# EAGLE design brushless_module_v3 (EAGLE 6.5.0)

## Sheet 1 of 13
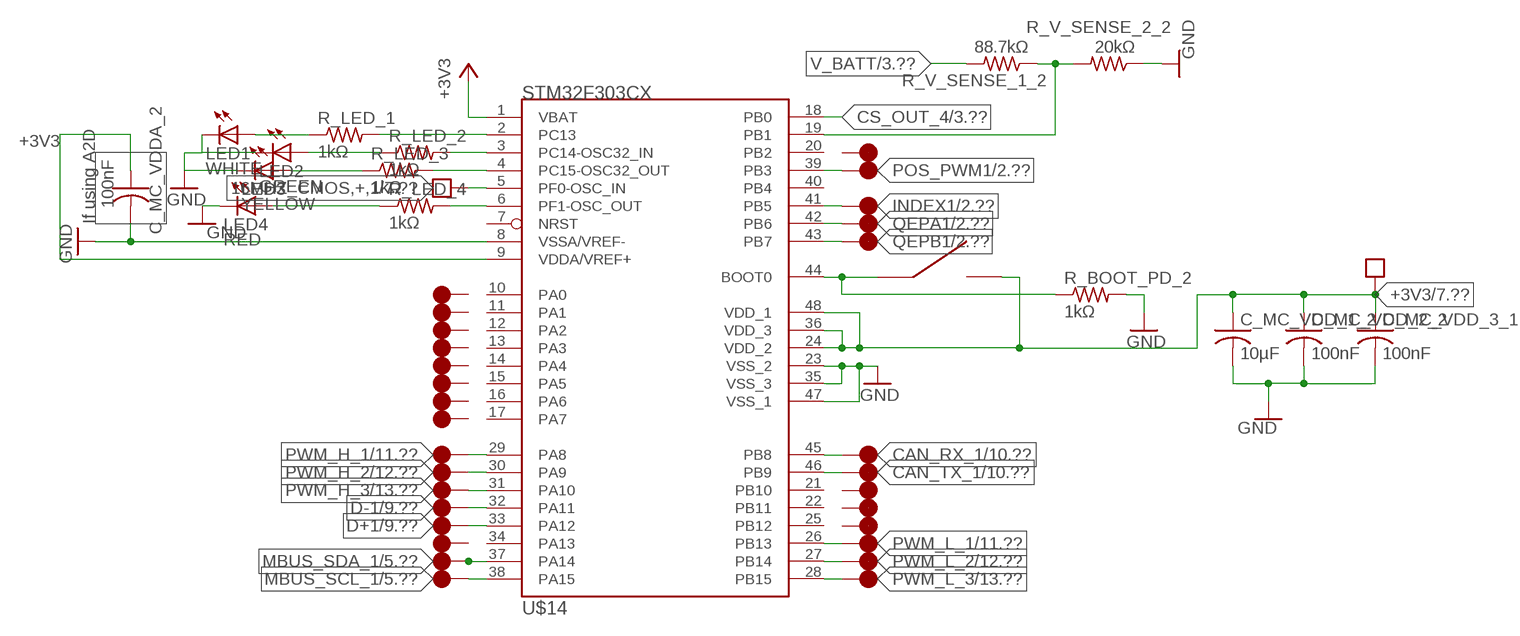
[diagram p0: schematic, sheet 1]

### Parts
C_MC_VDD_1_2  10µF  C-USC0402  [C0402]
C_MC_VDD_2_2  100nF  C-USC0402  [C0402]
C_MC_VDD_3_1  100nF  C-USC0402  [C0402]
C_MC_VDDA_2  100nF  C-USC0402  [C0402]
LED1  WHITE  LED  [0402]
LED2  GREEN  LED  [0402]
LED3  YELLOW  LED  [0402]
LED4  RED  LED  [0402]
R_BOOT_PD_2  1kΩ  R-US_R0402  [R0402]
R_LED_1  1kΩ  R-US_R0402  [R0402]
R_LED_2  1kΩ  R-US_R0402  [R0402]
R_LED_3  1kΩ  R-US_R0402  [R0402]
R_LED_4  1kΩ  R-US_R0402  [R0402]
R_V_SENSE_1_2  88.7kΩ  R-US_R0402  [R0402]
R_V_SENSE_2_2  20kΩ  R-US_R0402  [R0402]
SW2  B3U  [B3U]
U$14  STM32F303CX  [LQFP48]

### Nets
16MHZ_CMOS,+,1: U$14.5(PF0-OSC_IN) ; supply symbol labelled BLOCK_REQUIREMENT ; also sheet 7
+3V3: C_MC_VDD_1_2.1 C_MC_VDD_2_2.1 C_MC_VDD_3_1.1 C_MC_VDDA_2.1 SW2.P$2 U$14.1(VBAT) U$14.9(VDDA/VREF+) U$14.24(VDD_2) U$14.36(VDD_3) U$14.48(VDD_1) ; supply symbol labelled BLOCK_REQUIREMENT ; also sheet 2,3,5,7,8,10
BOOT0_2: R_BOOT_PD_2.1 SW2.P$1 U$14.44(BOOT0)
CAN_RX_1: U$14.45(PB8) ; supply symbol labelled BLOCK_CONNECTOR ; also sheet 10
CAN_TX_1: U$14.46(PB9) ; supply symbol labelled BLOCK_CONNECTOR ; also sheet 10
CS_OUT_4: U$14.18(PB0) ; also sheet 3
D+1: U$14.33(PA12) ; supply symbol labelled BLOCK_CONNECTOR ; also sheet 9
D-1: U$14.32(PA11) ; supply symbol labelled BLOCK_CONNECTOR ; also sheet 9
GND: C_MC_VDD_1_2.2 C_MC_VDD_2_2.2 C_MC_VDD_3_1.2 C_MC_VDDA_2.2 LED1.CATHODE(C) LED2.CATHODE(C) LED3.CATHODE(C) LED4.CATHODE(C) R_BOOT_PD_2.2 R_V_SENSE_2_2.1 U$14.8(VSSA/VREF-) U$14.23(VSS_2) U$14.35(VSS_3) U$14.47(VSS_1) ; also sheet 2,3,4,5,6,7,8,9,10,11,12,13
INDEX1: U$14.41(PB5) ; supply symbol labelled BLOCK_CONNECTOR ; also sheet 2
LED_1: R_LED_1.2 U$14.2(PC13)
LED_2: R_LED_2.2 U$14.3(PC14-OSC32_IN)
LED_3: R_LED_3.2 U$14.4(PC15-OSC32_OUT)
LED_4: R_LED_4.2 U$14.6(PF1-OSC_OUT)
MBUS_SCL_1: U$14.38(PA15) ; supply symbol labelled BLOCK_CONNECTOR ; also sheet 5
MBUS_SDA_1: U$14.37(PA14) ; supply symbol labelled BLOCK_CONNECTOR ; also sheet 5
N$4: LED4.ANODE(A) R_LED_4.1
N$5: LED3.ANODE(A) R_LED_3.1
N$8: LED2.ANODE(A) R_LED_2.1
N$10: LED1.ANODE(A) R_LED_1.1
POS_PWM1: U$14.39(PB3) ; supply symbol labelled BLOCK_CONNECTOR ; also sheet 2
PWM_H_1: U$14.29(PA8) ; supply symbol labelled BLOCK_CONNECTOR ; also sheet 11
PWM_H_2: U$14.30(PA9) ; supply symbol labelled BLOCK_CONNECTOR ; also sheet 12
PWM_H_3: U$14.31(PA10) ; supply symbol labelled BLOCK_CONNECTOR ; also sheet 13
PWM_L_1: U$14.26(PB13) ; supply symbol labelled BLOCK_CONNECTOR ; also sheet 11
PWM_L_2: U$14.27(PB14) ; supply symbol labelled BLOCK_CONNECTOR ; also sheet 12
PWM_L_3: U$14.28(PB15) ; supply symbol labelled BLOCK_CONNECTOR ; also sheet 13
QEPA1: U$14.42(PB6) ; supply symbol labelled BLOCK_CONNECTOR ; also sheet 2
QEPB1: U$14.43(PB7) ; supply symbol labelled BLOCK_CONNECTOR ; also sheet 2
V_BATT: R_V_SENSE_1_2.2 ; also sheet 3,4,6
VS_OUT: R_V_SENSE_1_2.1 R_V_SENSE_2_2.2 U$14.19(PB1)
Unconnected: U$14.7(NRST) U$14.10(PA0) U$14.11(PA1) U$14.12(PA2) U$14.13(PA3) U$14.14(PA4) U$14.15(PA5) U$14.16(PA6) U$14.17(PA7) U$14.20(PB2) U$14.21(PB10) U$14.22(PB11) U$14.25(PB12) U$14.34(PA13) U$14.40(PB4)

### Notes on the sheet
- If using A2D

## Sheet 2 of 13
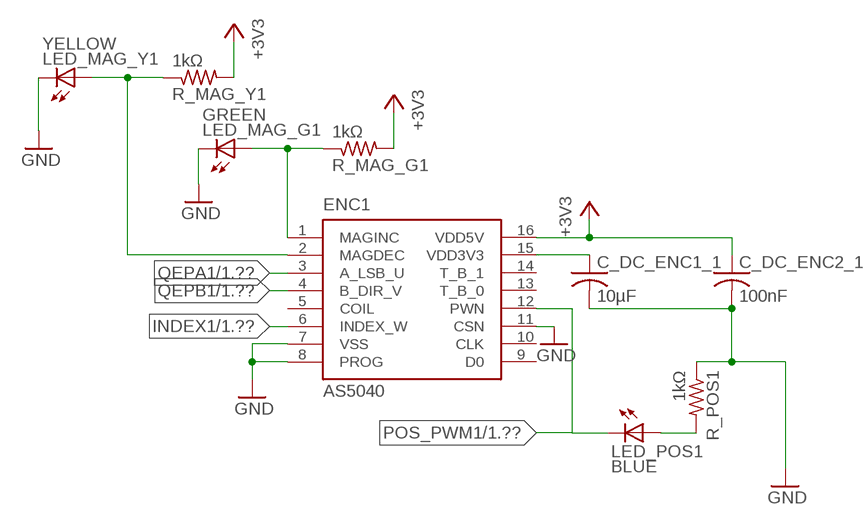
[diagram p1: schematic, sheet 2]

### Parts
C_DC_ENC1_1  10µF  C-USC0402  [C0402]
C_DC_ENC2_1  100nF  C-USC0402  [C0402]
ENC1  AS5040  [SSOP16]
LED_MAG_G1  GREEN  LED  [0402]
LED_MAG_Y1  YELLOW  LED  [0402]
LED_POS1  BLUE  LED  [0402]
R_MAG_G1  1kΩ  R-US_R0402  [R0402]
R_MAG_Y1  1kΩ  R-US_R0402  [R0402]
R_POS1  1kΩ  R-US_R0402  [R0402]

### Nets
+3V3: C_DC_ENC2_1.1 ENC1.16(VDD5V) R_MAG_G1.2 R_MAG_Y1.2 ; also sheet 1,3,5,7,8,10
ENC_3V3_1: C_DC_ENC1_1.1 ENC1.15(VDD3V3)
GND: C_DC_ENC1_1.2 C_DC_ENC2_1.2 ENC1.7(VSS) ENC1.8(PROG) ENC1.11(CSN) LED_MAG_G1.CATHODE(C) LED_MAG_Y1.CATHODE(C) R_POS1.1 ; also sheet 1,3,4,5,6,7,8,9,10,11,12,13
INDEX1: ENC1.6(INDEX_W) ; also sheet 1
MAGDEC1: ENC1.2(MAGDEC) LED_MAG_Y1.ANODE(A) R_MAG_Y1.1
MAGINC1: ENC1.1(MAGINC) LED_MAG_G1.ANODE(A) R_MAG_G1.1
N$15: LED_POS1.ANODE(A) R_POS1.2
POS_PWM1: ENC1.12(PWN) LED_POS1.CATHODE(C) ; also sheet 1
QEPA1: ENC1.3(A_LSB_U) ; also sheet 1
QEPB1: ENC1.4(B_DIR_V) ; also sheet 1
Unconnected: ENC1.5(COIL) ENC1.9(D0) ENC1.10(CLK) ENC1.13(T_B_0) ENC1.14(T_B_1)

## Sheet 3 of 13
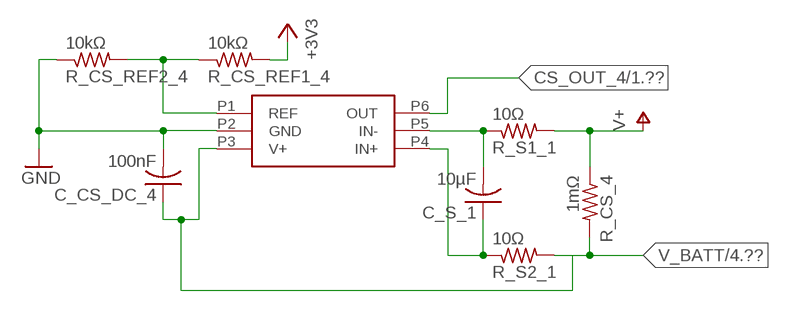
[diagram p2: schematic, sheet 3]

### Parts
C_CS_DC_4  100nF  C-USC0402  [C0402]
C_S_1  10µF  C-USC0402  [C0402]
CS_4  INA21X  [SC70]
R_CS_4  1mΩ  R-US_R1206  [R1206]
R_CS_REF1_4  10kΩ  R-US_R0402  [R0402]
R_CS_REF2_4  10kΩ  R-US_R0402  [R0402]
R_S1_1  10Ω  R-US_R0402  [R0402]
R_S2_1  10Ω  R-US_R0402  [R0402]

### Nets
+3V3: R_CS_REF1_4.2 ; also sheet 1,2,5,7,8,10
CS_OUT_4: CS_4.P6(OUT) ; also sheet 1
GND: C_CS_DC_4.2 CS_4.P2(GND) R_CS_REF2_4.1 ; also sheet 1,2,4,5,6,7,8,9,10,11,12,13
IN+_1: C_S_1.1 CS_4.P4(IN+) R_S2_1.1
IN-_1: C_S_1.2 CS_4.P5(IN-) R_S1_1.1
V+: R_CS_4.1 R_S1_1.2 ; also sheet 8,11,12,13
V_BATT: C_CS_DC_4.1 CS_4.P3(V+) R_CS_4.2 R_S2_1.2 ; also sheet 1,4,6
V_REF_CS: CS_4.P1(REF) R_CS_REF1_4.1 R_CS_REF2_4.2

## Sheet 4 of 13
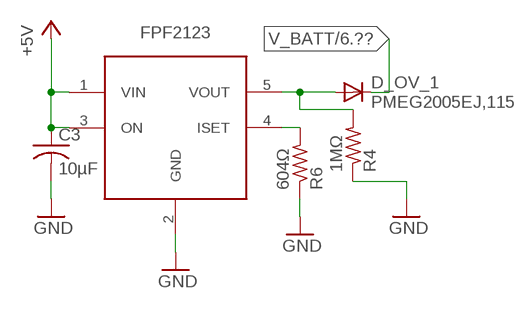
[diagram p3: schematic, sheet 4]

### Parts
C3  10µF  C-USC0402  [C0402]
D_OV_1  PMEG2005EJ,115  DIODE-SOD323-W  [SOD323-W]
FPF2123  FPF2123  [SOT23-5L]
R4  1MΩ  R-US_R0402  [R0402]
R6  604Ω  R-US_R0402  [R0402]

### Nets
+5V: C3.1 FPF2123.1(VIN) FPF2123.3(ON) ; also sheet 9
GND: C3.2 FPF2123.2(GND) R4.1 R6.1 ; also sheet 1,2,3,5,6,7,8,9,10,11,12,13
LOAD_ISET_1: FPF2123.4(ISET) R6.2
N$17: D_OV_1.A FPF2123.5(VOUT) R4.2
V_BATT: D_OV_1.C ; also sheet 1,3,6

## Sheet 5 of 13
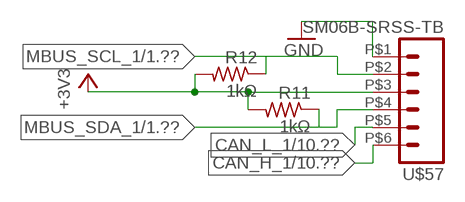
[diagram p4: schematic, sheet 5]

### Parts
R11  1kΩ  R-US_R0402  [R0402]
R12  1kΩ  R-US_R0402  [R0402]
U$57  SM06B-SRSS-TB  [SM06B-SRSS-TB]

### Nets
+3V3: R11.2 R12.2 U$57.P$3 ; also sheet 1,2,3,7,8,10
CAN_H_1: U$57.P$6 ; also sheet 10
CAN_L_1: U$57.P$5 ; also sheet 10
GND: U$57.P$1 ; also sheet 1,2,3,4,6,7,8,9,10,11,12,13
MBUS_SCL_1: R12.1 U$57.P$2 ; also sheet 1
MBUS_SDA_1: R11.1 U$57.P$4 ; also sheet 1

## Sheet 6 of 13
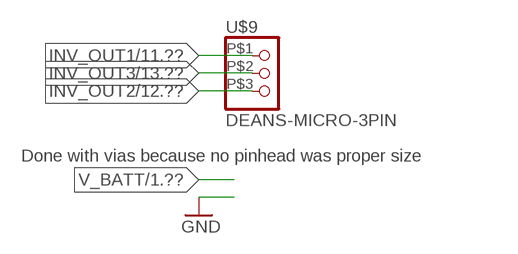
[diagram p5: schematic, sheet 6]

### Parts
U$9  DEANS-MICRO-3PIN  [DEANS-MICRO-3PIN]

### Nets
INV_OUT1: U$9.P$1 ; also sheet 11
INV_OUT2: U$9.P$3 ; also sheet 12
INV_OUT3: U$9.P$2 ; also sheet 13

### Notes on the sheet
- Done with vias because no pinhead was proper size

## Sheet 7 of 13
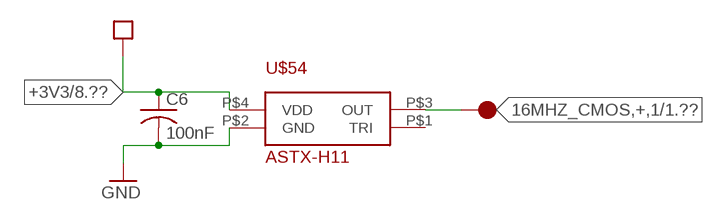
[diagram p6: schematic, sheet 7]

### Parts
C6  100nF  C-USC0402  [C0402]
U$54  ASTX-H11  [ASTX-H11]

### Nets
16MHZ_CMOS,+,1: U$54.P$3(OUT) ; supply symbol labelled BLOCK_CONNECTOR ; also sheet 1
+3V3: C6.1 U$54.P$4(VDD) ; supply symbol labelled BLOCK_REQUIREMENT ; also sheet 1,2,3,5,8,10
GND: C6.2 U$54.P$2(GND) ; also sheet 1,2,3,4,5,6,8,9,10,11,12,13
Unconnected: U$54.P$1(TRI)

## Sheet 8 of 13
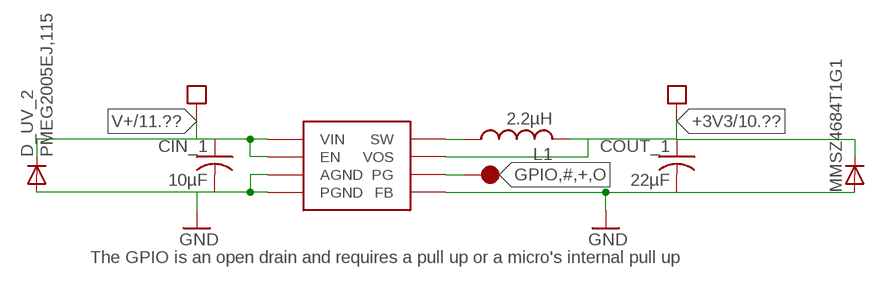
[diagram p7: schematic, sheet 8]

### Parts
CIN_1  10µF  C-USC0603  [C0603]
COUT_1  22µF  C-USC0603  [C0603]
D_UV_2  PMEG2005EJ,115  DIODE-SOD323-W  [SOD323-W]
L1  2.2µH  L-USL2012C  [L2012C]
MMSZ4684T1G1  D-SOD123  [SOD123]
U$37  TPS621XX  [8-WFDFN]

### Nets
+3V3: COUT_1.1 L1.2 MMSZ4684T1G1.1(C) U$37.P$6(VOS) ; supply symbol labelled BLOCK_REQUIREMENT ; also sheet 1,2,3,5,7,10
GND: CIN_1.2 COUT_1.2 D_UV_2.A MMSZ4684T1G1.2(A) U$37.P$1(PGND) U$37.P$4(AGND) U$37.P$5(FB) U$37.P$9(AGND) ; also sheet 1,2,3,4,5,6,7,9,10,11,12,13
GPIO,#,+,O: U$37.P$8(PG) ; supply symbol labelled BLOCK_CONNECTOR
N$3: L1.1 U$37.P$7(SW)
V+: CIN_1.1 D_UV_2.C U$37.P$2(VIN) U$37.P$3(EN) ; supply symbol labelled BLOCK_REQUIREMENT ; also sheet 3,11,12,13

### Notes on the sheet
- The GPIO is an open drain and requires a pull up or a micro's internal pull up

## Sheet 9 of 13
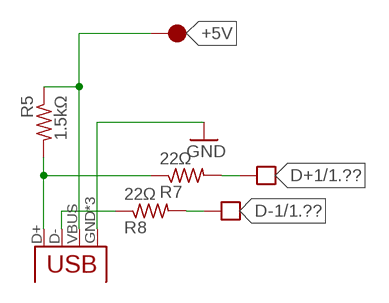
[diagram p8: schematic, sheet 9]

### Parts
R5  1.5kΩ  R-US_R0402  [R0402]
R7  22Ω  R-US_R0402  [R0402]
R8  22Ω  R-US_R0402  [R0402]
X1  USB-MICROB  [USB-MICROB]

### Nets
+5V: R5.1 X1.VBUS ; supply symbol labelled BLOCK_CONNECTOR ; also sheet 4
D+1: R7.2 ; supply symbol labelled BLOCK_REQUIREMENT ; also sheet 1
D+_IN_2: R5.2 R7.1 X1.D+
D-1: R8.2 ; supply symbol labelled BLOCK_REQUIREMENT ; also sheet 1
D-_IN_2: R8.1 X1.D-
GND: X1.GND X1.MT1(GND) X1.MT2(GND) ; also sheet 1,2,3,4,5,6,7,8,10,11,12,13

## Sheet 10 of 13
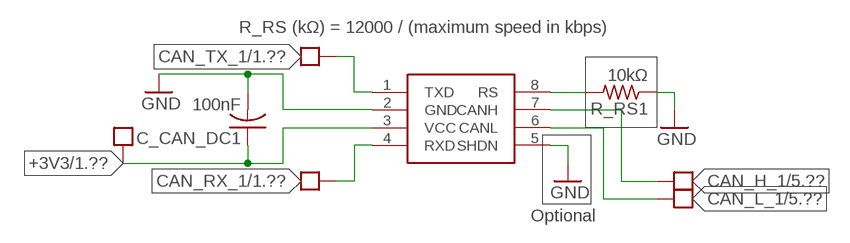
[diagram p9: schematic, sheet 10]

### Parts
C_CAN_DC1  100nF  C-USC0402  [C0402]
CAN_TRAN1  MAX3051  [SOT23-8L]
R_RS1  10kΩ  R-US_R0402  [R0402]

### Nets
+3V3: C_CAN_DC1.1 CAN_TRAN1.3(VCC) ; supply symbol labelled BLOCK_REQUIREMENT ; also sheet 1,2,3,5,7,8
CAN_H_1: CAN_TRAN1.7(CANH) ; supply symbol labelled BLOCK_REQUIREMENT ; also sheet 5
CAN_L_1: CAN_TRAN1.6(CANL) ; supply symbol labelled BLOCK_REQUIREMENT ; also sheet 5
CAN_RX_1: CAN_TRAN1.4(RXD) ; supply symbol labelled BLOCK_REQUIREMENT ; also sheet 1
CAN_TX_1: CAN_TRAN1.1(TXD) ; supply symbol labelled BLOCK_REQUIREMENT ; also sheet 1
GND: C_CAN_DC1.2 CAN_TRAN1.2(GND) CAN_TRAN1.5(SHDN) R_RS1.1 ; also sheet 1,2,3,4,5,6,7,8,9,11,12,13
N$6: CAN_TRAN1.8(RS) R_RS1.2

### Notes on the sheet
- R_RS (kΩ) = 12000 / (maximum speed in kbps)
- Optional

## Sheet 11 of 13
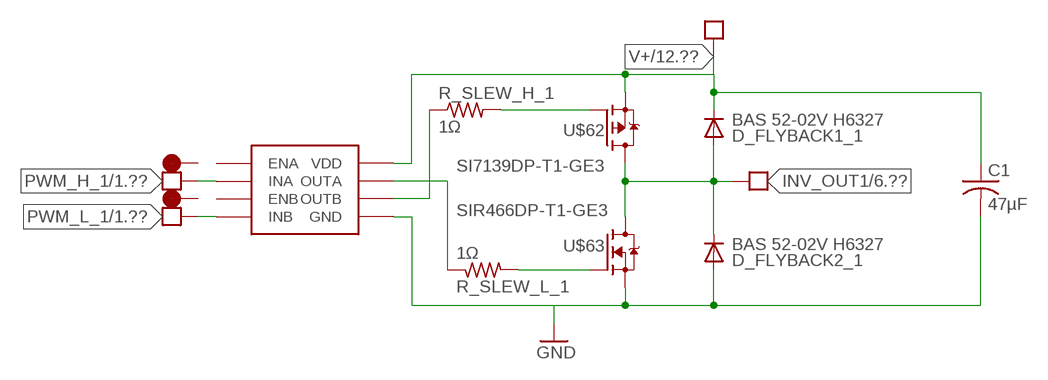
[diagram p10: schematic, sheet 11]

### Parts
C1  47µF  C-USC1206  [C1206]
D_FLYBACK1_1  BAS 52-02V H6327  DIODE-SOD523  [SOD523]
D_FLYBACK2_1  BAS 52-02V H6327  DIODE-SOD523  [SOD523]
R_SLEW_H_1  1Ω  R-US_R0402  [R0402]
R_SLEW_L_1  1Ω  R-US_R0402  [R0402]
U$62  SI7139DP-T1-GE3  [S0-8-POWERPAK]
U$63  SIR466DP-T1-GE3  [S0-8-POWERPAK]
U$64  UCC2752XUCC27524DSD  [8-WDFN]

### Nets
DRIVER_OUT_H_1: R_SLEW_H_1.1 U$64.P5(OUTB)
DRIVER_OUT_L_1: R_SLEW_L_1.1 U$64.P7(OUTA)
GATE_H_1: R_SLEW_H_1.2 U$62.4(G)
GATE_L_1: R_SLEW_L_1.2 U$63.4(G)
GND: C1.2 D_FLYBACK2_1.A U$63.1(S) U$63.2(S) U$63.3(S) U$64.EP(GND) U$64.P3(GND) ; also sheet 1,2,3,4,5,6,7,8,9,10,12,13
INV_OUT1: D_FLYBACK1_1.A D_FLYBACK2_1.C U$62.5(D) U$62.6(D) U$62.7(D) U$62.8(D) U$62.P$1(D) U$63.5(D) U$63.6(D) U$63.7(D) U$63.8(D) U$63.P$1(D) ; supply symbol labelled BLOCK_REQUIREMENT ; also sheet 6
PWM_H_1: U$64.P2(INA) ; supply symbol labelled BLOCK_REQUIREMENT ; also sheet 1
PWM_L_1: U$64.P4(INB) ; supply symbol labelled BLOCK_REQUIREMENT ; also sheet 1
V+: C1.1 D_FLYBACK1_1.C U$62.1(S) U$62.2(S) U$62.3(S) U$64.P6(VDD) ; supply symbol labelled BLOCK_REQUIREMENT ; also sheet 3,8,12,13
Unconnected: U$64.P1(ENA) U$64.P8(ENB)

## Sheet 12 of 13
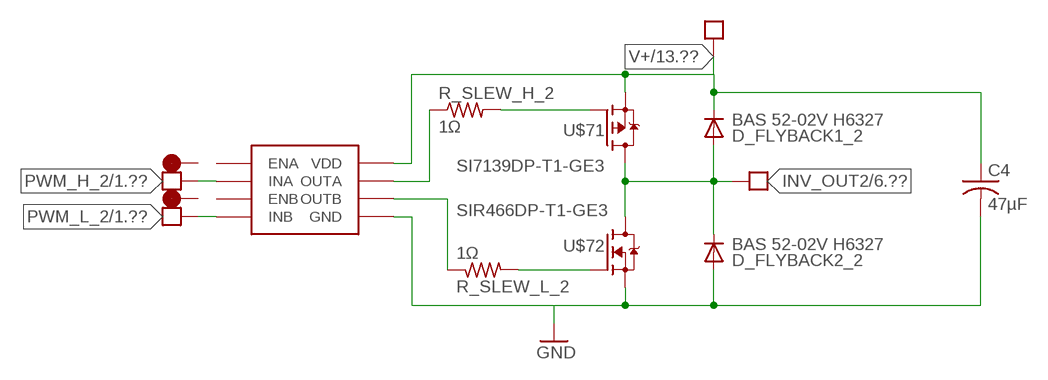
[diagram p11: schematic, sheet 12]

### Parts
C4  47µF  C-USC1206  [C1206]
D_FLYBACK1_2  BAS 52-02V H6327  DIODE-SOD523  [SOD523]
D_FLYBACK2_2  BAS 52-02V H6327  DIODE-SOD523  [SOD523]
R_SLEW_H_2  1Ω  R-US_R0402  [R0402]
R_SLEW_L_2  1Ω  R-US_R0402  [R0402]
U$71  SI7139DP-T1-GE3  [S0-8-POWERPAK]
U$72  SIR466DP-T1-GE3  [S0-8-POWERPAK]
U$73  UCC2752XUCC27524DSD  [8-WDFN]

### Nets
DRIVER_OUT_H_2: R_SLEW_H_2.1 U$73.P7(OUTA)
DRIVER_OUT_L_2: R_SLEW_L_2.1 U$73.P5(OUTB)
GATE_H_2: R_SLEW_H_2.2 U$71.4(G)
GATE_L_2: R_SLEW_L_2.2 U$72.4(G)
GND: C4.2 D_FLYBACK2_2.A U$72.1(S) U$72.2(S) U$72.3(S) U$73.EP(GND) U$73.P3(GND) ; also sheet 1,2,3,4,5,6,7,8,9,10,11,13
INV_OUT2: D_FLYBACK1_2.A D_FLYBACK2_2.C U$71.5(D) U$71.6(D) U$71.7(D) U$71.8(D) U$71.P$1(D) U$72.5(D) U$72.6(D) U$72.7(D) U$72.8(D) U$72.P$1(D) ; supply symbol labelled BLOCK_REQUIREMENT ; also sheet 6
PWM_H_2: U$73.P2(INA) ; supply symbol labelled BLOCK_REQUIREMENT ; also sheet 1
PWM_L_2: U$73.P4(INB) ; supply symbol labelled BLOCK_REQUIREMENT ; also sheet 1
V+: C4.1 D_FLYBACK1_2.C U$71.1(S) U$71.2(S) U$71.3(S) U$73.P6(VDD) ; supply symbol labelled BLOCK_REQUIREMENT ; also sheet 3,8,11,13
Unconnected: U$73.P1(ENA) U$73.P8(ENB)

## Sheet 13 of 13
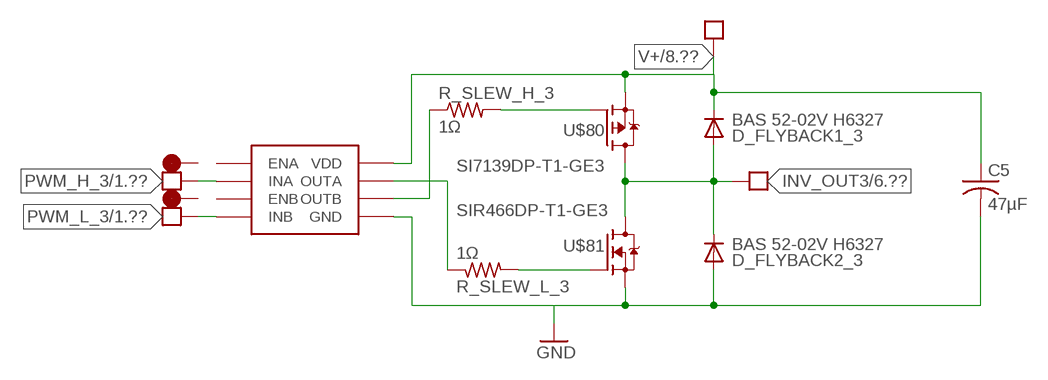
[diagram p12: schematic, sheet 13]

### Parts
C5  47µF  C-USC1206  [C1206]
D_FLYBACK1_3  BAS 52-02V H6327  DIODE-SOD523  [SOD523]
D_FLYBACK2_3  BAS 52-02V H6327  DIODE-SOD523  [SOD523]
R_SLEW_H_3  1Ω  R-US_R0402  [R0402]
R_SLEW_L_3  1Ω  R-US_R0402  [R0402]
U$80  SI7139DP-T1-GE3  [S0-8-POWERPAK]
U$81  SIR466DP-T1-GE3  [S0-8-POWERPAK]
U$82  UCC2752XUCC27524DSD  [8-WDFN]

### Nets
DRIVER_OUT_H_3: R_SLEW_H_3.1 U$82.P5(OUTB)
DRIVER_OUT_L_3: R_SLEW_L_3.1 U$82.P7(OUTA)
GATE_H_3: R_SLEW_H_3.2 U$80.4(G)
GATE_L_3: R_SLEW_L_3.2 U$81.4(G)
GND: C5.2 D_FLYBACK2_3.A U$81.1(S) U$81.2(S) U$81.3(S) U$82.EP(GND) U$82.P3(GND) ; also sheet 1,2,3,4,5,6,7,8,9,10,11,12
INV_OUT3: D_FLYBACK1_3.A D_FLYBACK2_3.C U$80.5(D) U$80.6(D) U$80.7(D) U$80.8(D) U$80.P$1(D) U$81.5(D) U$81.6(D) U$81.7(D) U$81.8(D) U$81.P$1(D) ; supply symbol labelled BLOCK_REQUIREMENT ; also sheet 6
PWM_H_3: U$82.P2(INA) ; supply symbol labelled BLOCK_REQUIREMENT ; also sheet 1
PWM_L_3: U$82.P4(INB) ; supply symbol labelled BLOCK_REQUIREMENT ; also sheet 1
V+: C5.1 D_FLYBACK1_3.C U$80.1(S) U$80.2(S) U$80.3(S) U$82.P6(VDD) ; supply symbol labelled BLOCK_REQUIREMENT ; also sheet 3,8,11,12
Unconnected: U$82.P1(ENA) U$82.P8(ENB)

## Library data of the parts
C1 C3-C6 C_CAN_DC1 C_CS_DC_4 C_DC_ENC1_1 C_DC_ENC2_1 C_MC_VDD_1_2 C_MC_VDD_2_2 C_MC_VDD_3_1 C_MC_VDDA_2 C_S_1 CIN_1 COUT_1 = rcl:C-US: CAPACITOR, American symbol
CAN_TRAN1 = piccoli:MAX3051
CS_4 = piccoli:INA21X
D_FLYBACK1_1-D_FLYBACK1_3 D_FLYBACK2_1-D_FLYBACK2_3 D_OV_1 D_UV_2 = diode:DIODE-: DIODE
ENC1 = austriamicrosystems:AS5040: 10-BIT PROGRAMMABLE MAGNETIC ROTARY ENCODER Source: www.austriamicrosystems.com .. AS5040DataSheetRev12.pdf; MPN: AS5040ASSU; OC_FARNELL: 1630800; OC_NEWARK: 59P4059
FPF2123 = neels:FPF2123
L1 = rcl:L-US: INDUCTOR, American symbol
LED1-LED4 LED_MAG_G1 LED_MAG_Y1 LED_POS1 = piccoli:LED
MMSZ4684T1G1 = semicon-smd-ipc:D-: DIODE unfilled
R4-R8 R11 R12 R_BOOT_PD_2 R_CS_REF1_4 R_CS_REF2_4 R_LED_1-R_LED_4 R_MAG_G1 R_MAG_Y1 R_POS1 R_RS1 R_S1_1 R_S2_1 R_SLEW_H_1-R_SLEW_H_3 R_SLEW_L_1-R_SLEW_L_3 R_V_SENSE_1_2 R_V_SENSE_2_2 = rcl:R-US_: RESISTOR, American symbol
R_CS_4 = resistor:R-US_: RESISTOR, American symbol
SW2 = zz-upenn:B3U
U$9 = piccoli:DEANS-MICRO-3PIN
U$14 = piccoli:STM32F303CX
U$37 = piccoli:TPS621XX
U$54 = block_parts:ASTX-H11
U$57 = block_parts:SM06B-SRSS-TB
U$62 U$71 U$80 = piccoli:SI7139DP-T1-GE3
U$63 U$72 U$81 = piccoli:SIR466DP-T1-GE3
U$64 U$73 U$82 = piccoli:UCC2752X: Dual 5-A High-Speed Low-Side Gate Driver
X1 = SparkFun:USB: USB Connectors USB-B-PTH is fully proven SKU : PRT-00139 USB-miniB is fully proven SKU : PRT-00587 USB-A-PCB is untested. USB-A-H is throughly reviewed, but untested. Spark Fun Electronics SKU : PRT-00437 USB-B-SMT is throughly reviewed, but untested. Needs silkscreen touching up. USB-A-S has not been used/tested USB-MB-H has not been used/tested

## Board
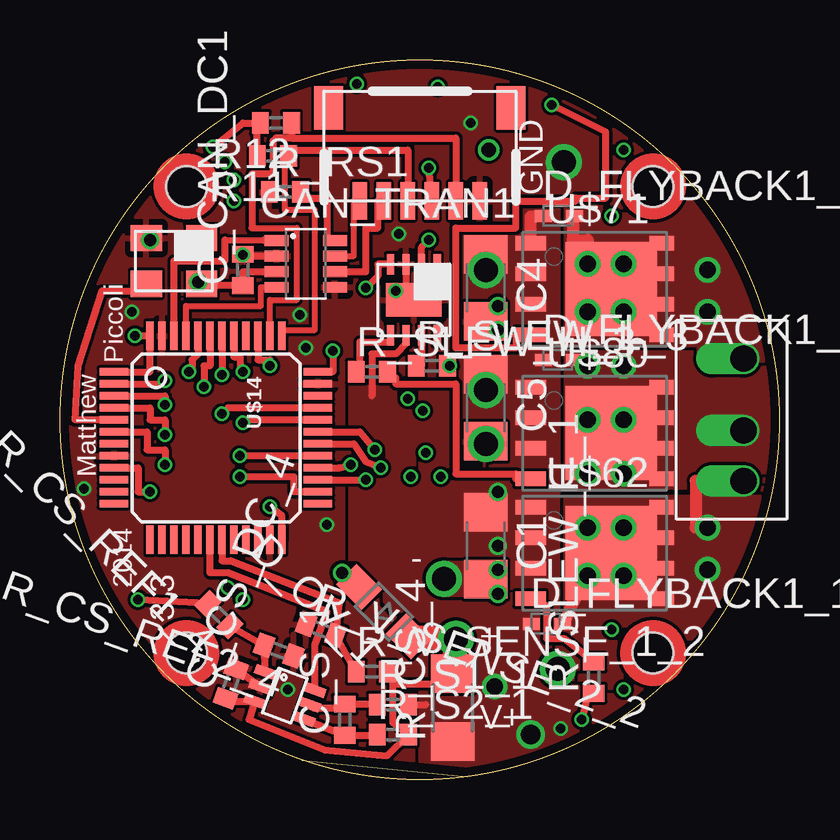
[diagram p13: board, top side]
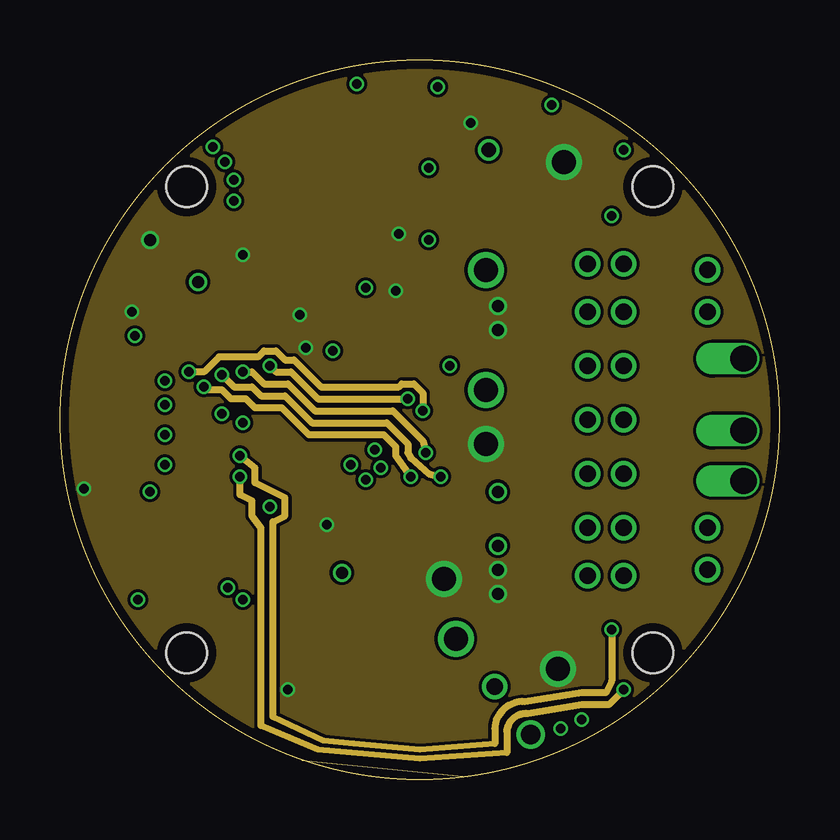
[diagram p14: board, inner layer Route2]
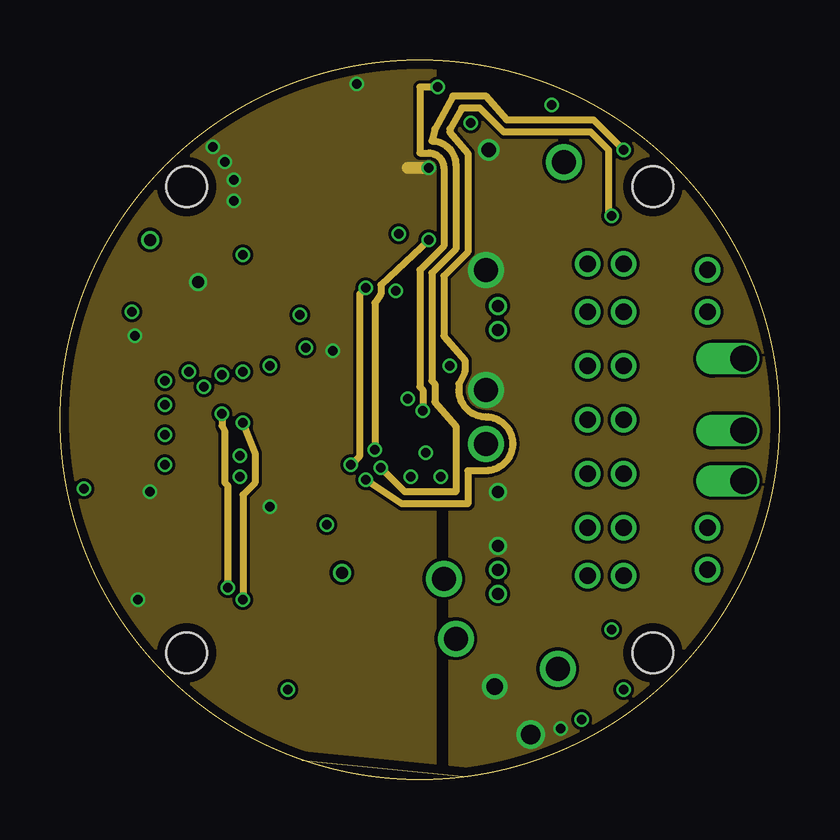
[diagram p15: board, inner layer Route15]
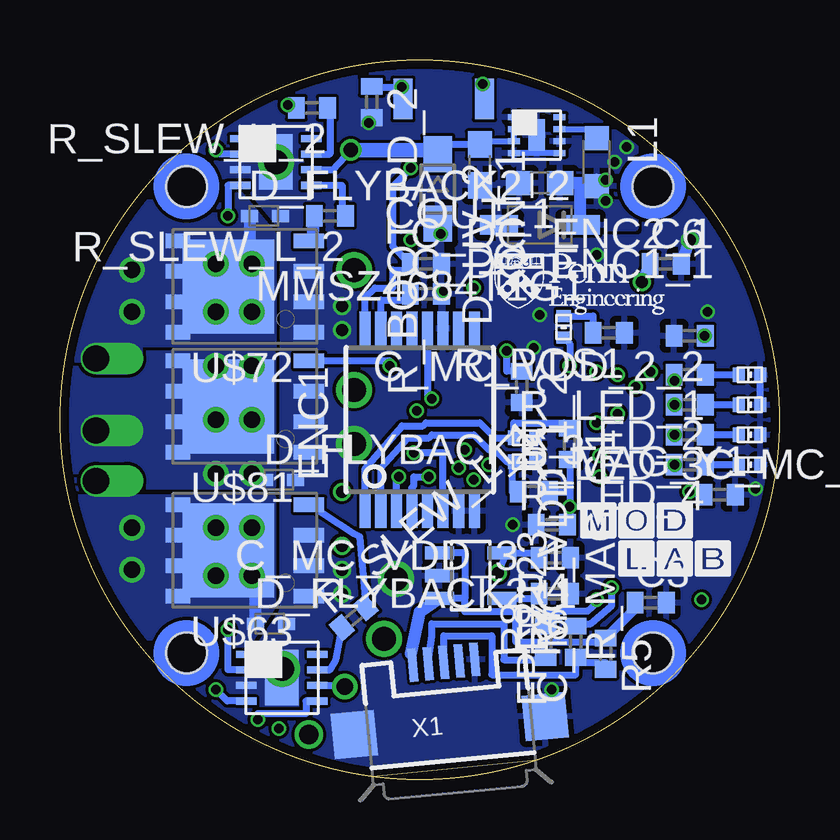
[diagram p16: board, bottom side, seen from below]

Size 30 x 30 mm. Coordinates in mm from the lower left corner, seen from the top.
Outline: 10.1,0.8 17,0.12
Outline: circle at 15,15 radius 15
Copper layers ((1+2)*(15+16)): Top 0.035559375mm / dielectric 0.17018125mm / Route2 0.01778125mm / dielectric 47mil / Route15 0.01778125mm / dielectric 0.17018125mm / Bottom 0.035559375mm
Design rules "OSHPark 4 Layer": minimum track width 5mil, minimum drill 10mil, track to track 5mil, track to pad 5mil, pad to pad 5mil, via to via 5mil, smd to smd 5mil, copper to edge 15mil, drill to drill 6mil, minimum pad ring 4mil, minimum via ring 4mil, stop-mask expansion 4mil, vias tented up to drill 0mil, thermal gap 10mil
Holes 1.7 mm at 5.28,5.28 5.28,24.72 24.72,24.72 24.72,5.28

### Footprints (pad centres in the part's own frame; a part is rotated, then mirrored left to right if it is on the bottom)
C1206 = smd 1.6 x 1.8: 1 -1.4,0; 2 1.4,0
C0402 = smd 0.7 x 0.9: 1 -0.65,0; 2 0.65,0
SOT23-8L = smd 0.45 x 1: 1 -0.975,-1.225; 2 -0.325,-1.225; 3 0.325,-1.225; 4 0.975,-1.225; 5 0.975,1.225; 6 0.325,1.225; 7 -0.325,1.225; 8 -0.975,1.225
C0603 = smd 1.1 x 1: 1 -0.85,0; 2 0.85,0
SC70 = smd 0.4 x 0.9: P1 -0.65,-1.1; P2 0,-1.1; P3 0.65,-1.1; P4 0.65,1.1; P5 0,1.1; P6 -0.65,1.1
SOD523 = smd 0.7 x 0.5: A 0.7,0; C -0.6,0
SOD323-W = smd 1.5 x 1.2: A 1.45,0; C -1.45,0
SSOP16 = smd 0.46 x 1.43: 1 -2.275,-3.795; 2 -1.625,-3.795; 3 -0.975,-3.795; 4 -0.325,-3.795; 5 0.325,-3.795; 6 0.975,-3.795; 7 1.625,-3.795; 8 2.275,-3.795; 9 2.275,3.795; 10 1.625,3.795; 11 0.975,3.795; 12 0.325,3.795; 13 -0.325,3.795; 14 -0.975,3.795; 15 -1.625,3.795; 16 -2.275,3.795
SOT23-5L = smd 0.55 x 1.2: 1 -0.95,-1.3; 2 0,-1.3; 3 0.95,-1.3; 4 0.95,1.3; 5 -0.95,1.3
L2012C = smd 1 x 1: 1 -1,0; 2 1,0
0402 = smd 0.5 x 0.6: ANODE 0.45,0; CATHODE -0.45,0
SOD123 = smd 1.6 x 0.8: 1 -1.7,0; 2 1.7,0
R0402 = smd 0.7 x 0.9: 1 -0.65,0; 2 0.65,0
R1206 = smd 1.6 x 1.803: 1 -1.422,0; 2 1.422,0
B3U = smd 0.8 x 1.7: P$1 -1.7,0; P$2 1.7,0
DEANS-MICRO-3PIN = drill 1.1 offset: P$1 -2.55,0; P$2 -0.45,0; P$3 2.55,0
LQFP48 = smd 0.3 x 1.2: 1 -2.75,-4.25; 2 -2.25,-4.25; 3 -1.75,-4.25; 4 -1.25,-4.25; 5 -0.75,-4.25; 6 -0.25,-4.25; 7 0.25,-4.25; 8 0.75,-4.25; 9 1.25,-4.25; 10 1.75,-4.25; 11 2.25,-4.25; 12 2.75,-4.25; 25 2.75,4.25; 26 2.25,4.25; 27 1.75,4.25; 28 1.25,4.25; 29 0.75,4.25; 30 0.25,4.25; 31 -0.25,4.25; 32 -0.75,4.25; 33 -1.25,4.25; 34 -1.75,4.25; 35 -2.25,4.25; 36 -2.75,4.25 | smd 1.2 x 0.3: 13 4.25,-2.75; 14 4.25,-2.25; 15 4.25,-1.75; 16 4.25,-1.25; 17 4.25,-0.75; 18 4.25,-0.25; 19 4.25,0.25; 20 4.25,0.75; 21 4.25,1.25; 22 4.25,1.75; 23 4.25,2.25; 24 4.25,2.75; 37 -4.25,2.75; 38 -4.25,2.25; 39 -4.25,1.75; 40 -4.25,1.25; 41 -4.25,0.75; 42 -4.25,0.25; 43 -4.25,-0.25; 44 -4.25,-0.75; 45 -4.25,-1.25; 46 -4.25,-1.75; 47 -4.25,-2.25; 48 -4.25,-2.75
8-WFDFN = smd 0.25 x 0.5: P$1 0.75,0.95; P$2 0.25,0.95; P$3 -0.25,0.95; P$4 -0.75,0.95; P$5 -0.75,-0.95; P$6 -0.25,-0.95; P$7 0.25,-0.95; P$8 0.75,-0.95 | smd 1.3 x 0.7: P$9 0,0
ASTX-H11 = smd 1.3 x 1.1: P$1 -1.15,-0.95; P$2 1.15,-0.95; P$3 1.15,0.95; P$4 -1.15,0.95
SM06B-SRSS-TB = smd 0.6 x 1.55: P$1 -2.5,0; P$2 -1.5,0; P$3 -0.5,0; P$4 0.5,0; P$5 1.5,0; P$6 2.5,0 | smd 1.2 x 1.8: P$7 3.8,-3.875; P$8 -3.8,-3.875
S0-8-POWERPAK = smd 1.27 x 0.61: 1 -2.627,1.85; 2 -2.627,0.58; 3 -2.627,-0.69; 4 -2.627,-1.96 | smd 1.016 x 0.61: 5 2.834,-1.96; 6 2.834,-0.69; 7 2.834,0.58; 8 2.834,1.85 | smd 3.81 x 3.912: P$1 0.726,-0.055
8-WDFN = smd 2.3 x 1.4: EP 0,0 | smd 0.3 x 0.85: P1 0.975,1.485; P2 0.325,1.485; P3 -0.325,1.485; P4 -0.975,1.485; P5 -0.975,-1.485; P6 -0.325,-1.485; P7 0.325,-1.485; P8 0.975,-1.485
USB-MICROB = smd 0.35 x 1.4: D+ 0,2.65; D- -0.65,2.65; GND 1.3,2.65; ID 0.65,2.65; VBUS -1.3,2.65 | smd 1.8 x 1.9: MT1 -4,0; MT2 4,0

### Placement (x,y rotation side)
C1  17.75,9.75 270 top
C3  5.38,7.38 0 bottom
C4  17.75,20.5 270 top
C5  17.75,15.5 270 top
C6  4.75,21.5 0 bottom
C_CAN_DC1  7.62,21.25 90 top
C_CS_DC_4  7.12,4 70 top
C_DC_ENC1_1  14.75,20.25 0 bottom
C_DC_ENC2_1  14.75,21.5 0 bottom
C_MC_VDD_1_2  10.75,16.38 270 bottom
C_MC_VDD_2_2  3.75,18.5 180 bottom
C_MC_VDD_3_1  9.5,10.62 180 bottom
C_MC_VDDA_2  2.5,11.88 0 bottom
C_S_1  11.88,2.5 90 top
CAN_TRAN1  10.25,21.5 270 top
CIN_1  12.5,25.62 270 bottom
COUT_1  10,24.88 180 bottom
CS_4  9.38,3.5 250 top
D_FLYBACK1_1  20.25,6.5 0 top
D_FLYBACK1_2  20.75,23.5 0 top
D_FLYBACK1_3  20.75,17.5 0 top
D_FLYBACK2_1  21.25,6.5 0 bottom
D_FLYBACK2_2  21.5,23.5 0 bottom
D_FLYBACK2_3  20.88,12.5 0 bottom
D_OV_1  13.5,7 135 top
D_UV_2  14.25,24.62 270 bottom
ENC1  15,15 0 bottom
FPF2123  12.88,8.5 270 bottom
L1  7.62,25.75 270 bottom
LED1  1.25,16.88 180 bottom
LED2  1.25,15.62 180 bottom
LED3  1.25,14.38 180 bottom
LED4  1.25,13.12 180 bottom
LED_MAG_G1  10.62,14.25 180 bottom
LED_MAG_Y1  10.62,13.25 180 bottom
LED_POS1  9,18.88 90 bottom
MMSZ4684T1G1  10,23.12 180 bottom
R4  9.38,9.25 180 bottom
R5  7.25,5.25 270 bottom
R6  9.38,7.75 180 bottom
R7  8.5,5.75 90 bottom
R8  9.75,5.75 90 bottom
R11  8.88,26 180 top
R12  9,27.38 180 top
R_BOOT_PD_2  17,28.25 270 bottom
R_CS_4  16.38,3 90 top
R_CS_REF1_4  6.62,6.88 135 top
R_CS_REF2_4  9.12,5.38 160 top
R_LED_1  3.75,16.88 180 bottom
R_LED_2  3.75,15.62 180 bottom
R_LED_3  3.75,14.38 180 bottom
R_LED_4  3.75,13.12 180 bottom
R_MAG_G1  8.75,14 270 bottom
R_MAG_Y1  10.25,12 0 bottom
R_POS1  7.12,18.62 180 bottom
R_RS1  9.38,24.5 0 top
R_S1_1  13.88,3.12 0 top
R_S2_1  13.88,1.88 0 top
R_SLEW_H_1  22.25,4.25 90 top
R_SLEW_H_2  19.5,28 180 bottom
R_SLEW_H_3  13,17 0 top
R_SLEW_L_1  17.75,6.75 40 bottom
R_SLEW_L_2  18.75,23.5 180 bottom
R_SLEW_L_3  15.5,17.25 0 top
R_V_SENSE_1_2  13,4.5 0 top
R_V_SENSE_2_2  10.88,6.25 340 top
SW2  14,28.38 0 bottom
U$6  [MODLAB]  8.5,8.25 0 bottom
U$9  28.5,15 90 top
U$12  [PENN_ENGINEERING]  11.88,19.38 0 bottom
U$14  6.5,14.25 270 top
U$37  10.12,26.88 90 bottom
U$54  4.75,21.62 180 top
U$57  15,24.12 180 top
U$62  22.25,9.5 0 top
U$63  22.25,9.5 180 bottom
U$64  20.75,4.25 90 bottom
U$71  22.25,20.5 0 top
U$72  22.25,20.5 180 bottom
U$73  21,25.75 90 bottom
U$80  22.25,14.5 0 top
U$81  22.25,15.5 180 bottom
U$82  14.75,20 0 top
X1  13.75,2.25 5.4 bottom

### Tracks (layer width: path | path; a pad name or v marks a point on that pad's centre or on a via)
16MHZ_CMOS,+,1
  Top 0.3: U$14.5 0.62,15 0.75,17.25 1.75,20.38 3.3,20.38 arc90 U$54.P$3
+3V3  (via drill 0.4, 0.5)
  Top 0.3: CAN_TRAN1.3 7.62,21.18 C_CAN_DC1.1 5.9,20.6 U$54.P$4 v5.75,20.75 | U$57.P$3 v15.38,25.5 | v6.38,26.38 7.62,27.38 8.22,27.38 | v3.12,18.5 U$14.48 3.75,17 U$14.1 | R11.2 8.22,27.38 | 8.22,27.38 R12.2 | v11.38,17.88 11.38,17 U$14.36 | U$14.24 9.25,11 v8.75,11.38 | U$14.9 3.25,13 3.25,12 v3.75,12 | R_CS_REF1_4.2 v3.25,7.5
  Route15 0.5: v15.38,25.5 14.5,25.5
  Bottom 0.3: SW2.P$2 v12.38,29 | 7.62,25.12 L1.2 8,24.75 | v15.38,25.5 16.12,24.75 16.12,22.23 C_DC_ENC2_1.1 15.4,21.25 16.12,21.25 16.12,20.5 16.88,20.5 17.27,20.1 ENC1.16 | C_MC_VDD_2_2.1 v3.12,18.5 | C_MC_VDD_1_2.1 11.38,17.02 v11.38,17.88 | R_MAG_G1.2 8.75,12 | 8.75,12 v8.75,11.38 8.75,10.62 C_MC_VDD_3_1.1 | C_MC_VDDA_2.1 3.38,11.88 v3.75,12 | R_MAG_Y1.2 8.75,12
  Bottom 0.5: C6.1 v5.75,20.75 | MMSZ4684T1G1.1 8.3,24.88 9.12,24.88
  other vias: 6.88,25.75 7.25,25 7.25,24.12
  pour Route15: 15.62,30.12 arc90 0,15 arc90 15.62,0.12
  pour Bottom: 6,27 9.5,27 9.5,23 6,23
+5V
  Bottom 0.29: 11,5.75 11,7 13.12,7
  Bottom 0.3: 13.12,7.55 13.12,9.45 FPF2123.1 | 13.12,7.55 FPF2123.3 14.38,7.55 | 13.12,7 13.12,7.55 | 11,5.75 7.25,5.75 R5.1 | X1.VBUS 15.38,5.25
  Bottom 0.406: C3.1 6.03,7.12 R5.1
  Bottom 0.5: 14.5,7.55 FPF2123.3 15,7 15.38,5.25
BOOT0_2  (via drill 0.4)
  Top 0.3: U$14.44 5.75,17.75 5.5,17.5 5.5,17 v5.38,17
  Route2 0.3: v15.12,15.38 15.12,16.12 14.75,16.5 14.25,16.5 14.12,16.38 10.88,16.38 9.75,17.5 9.38,17.5 9,17.88 8.5,17.88 8.25,17.62 6.62,17.62 6,17 v5.38,17
  Route15 0.3: v15.75,28.88 15,28.88 15,26.12 15.38,26.12 arc-90 16,25.5 16,22.25 15,21.25 15,16.38 15.12,16.25 v15.12,15.38
  Bottom 0.3: v15.75,28.88 15.97,28.5 SW2.P$1 15.7,28.82 v15.75,28.88 | R_BOOT_PD_2.1 16.98,28.88 v15.75,28.88
CAN_H_1
  Top 0.25: CAN_TRAN1.7 12.25,21.82 12.25,24.12 U$57.P$6
CAN_L_1
  Top 0.3: CAN_TRAN1.6 12.75,21.18 12.75,23 13.25,23 13.25,24.12 U$57.P$5
CAN_RX_1
  Top 0.25: U$14.45 5.25,19.75 8.38,19.75 8.38,20.52 CAN_TRAN1.4
CAN_TX_1
  Top 0.25: 6.88,22.5 8.5,22.5
  Top 0.3: U$14.46 4.75,21.62 6.88,21.62 6.88,22.5 | 9,22.48 CAN_TRAN1.1 8.5,22.48 8.5,22.5
CS_OUT_4
  Top 0.3: CS_4.P6 10.62,5.62 11.12,7 7,8.62 6.25,8.62 U$14.18
D+1  (via drill 0.4)
  Top 0.3: U$14.33 7,15.5 v6.75,15.25
  Route15 0.3: v6.75,15.25 6.75,14.75 6.88,14.5 6.88,12.38 7,12.25 v7,8
  Bottom 0.3: R7.2 8.5,6.5 7.88,6.5 7,7.25 v7,8
D+_IN_2
  Bottom 0.3: X1.D+ 14,6 12,6 12,4.38 8.5,4.38 R7.1 8.5,4.88 7.25,4.88 R5.2
D-1  (via drill 0.4)
  Top 0.3: U$14.32 7.75,15 v7.62,14.88
  Route15 0.3: v7.62,14.88 8.12,13.62 8.12,12.38 7.62,11.88 v7.62,7.5
  Bottom 0.29: R8.2 9.75,7.03 8,7.03
  Bottom 0.3: 8,7.03 7.62,7.38 v7.62,7.5
D-_IN_2
  Bottom 0.3: X1.D- 14.5,6 14.5,6.5 11.5,6.5 11.5,5 10,5 R8.1
DRIVER_OUT_H_1  (via drill 0.4)
  Top 0.3: R_SLEW_H_1.1 22,3.6 v21.75,2.5
  Bottom 0.3: U$64.P5 19.75,3.27 19.75,2.75 21.75,2.75 v21.75,2.5
DRIVER_OUT_H_2
  Bottom 0.3: U$73.P7 18.75,26.07 18.75,27.65 R_SLEW_H_2.1
DRIVER_OUT_H_3
  Top 0.3: R_SLEW_H_3.1 12.5,17 12.5,18.25 13.78,18.25 U$82.P5
DRIVER_OUT_L_1
  Bottom 0.3: U$64.P7 18.75,4.58 18.5,5 R_SLEW_L_1.1
DRIVER_OUT_L_2
  Bottom 0.3: U$73.P5 18.25,24.77 18.25,23.75 18.1,23.75 R_SLEW_L_2.1
DRIVER_OUT_L_3
  Top 0.3: 14.82,17.25 R_SLEW_L_3.1 15.07,17.25 U$82.P7
ENC_3V3_1
  Bottom 0.3: ENC1.15 16.62,20 15.4,20 C_DC_ENC1_1.1
GATE_H_1
  Top 0.3: U$62.4 20.3,7.25 20.3,5.88 21.02,5.88 R_SLEW_H_1.2
GATE_H_2  (via drill 0.4)
  Top 0.3: U$71.4 19,18.5 19,18 16.5,18 16.5,23 19,23 19,24.12 21.5,24.12 21.5,24.25 22.75,24.25 22.75,27 v20.5,28.12
  Bottom 0.3: v20.5,28.12 R_SLEW_H_2.2
GATE_H_3
  Top 0.3: U$80.4 19,12.54 19,12.75 16.5,12.75 16.5,16.5 14,16.5 14,16.75 13.65,16.75 R_SLEW_H_3.2
GATE_L_1
  Bottom 0.3: 19.25,11.46 U$63.4 17.75,10.25 17.5,10.12 17.25,7.38 R_SLEW_L_1.2
GATE_L_2
  Bottom 0.5: R_SLEW_L_2.2 19.5,22.46 U$72.4
GATE_L_3  (via drill 0.4)
  Top 0.3: R_SLEW_L_3.2 v16.25,17.25
  Bottom 0.3: U$81.4 16.25,17.46 v16.25,17.25
GND  (via drill 0.4, 0.5, 1)
  Top 0.3: C5.2 v17.75,14 | C4.2 18.25,19.1 v18.25,18.75 | C1.2 v18.25,7.75 | C_CAN_DC1.2 v7.62,21.88 7.62,21.82 CAN_TRAN1.2 | U$82.P3 14.43,20.57 14.5,20.5 | C_CS_DC_4.2 CS_4.P2
  Bottom 0.25: U$37.P$5 U$37.P$4
  Bottom 0.3: LED2.CATHODE LED1.CATHODE
  Bottom 0.5: C6.2 v3.75,22.5
  other vias: 18.25,19.75 20.75,4.62 21,25.75 17.12,27.38 10,19.38 10.25,18 14.12,22.75 1,12.12 3,19.5 14,20.38 18.25,8.75 16,8.38 9.5,3.75 11.12,10.62
  pour Top (rank 6): 0,15 arc-90 15,30 arc-90 30,15 arc-90 15,0 arc-90
  pour Bottom (rank 6): 15,30 arc90 0,15 arc90 15,0 arc90 30,15 arc90
  pour Bottom (rank 5, no thermals): 15,30 30,30 30,0 15,0
  pour Route2: 15,30 arc90 0,15 arc90 15,0 arc90 30,15 arc90
  pour Top (no thermals): 16,9 18.25,9 18.25,7.75 16,7.75
IN+_1
  Top 0.3: R_S2_1.1 13.22,1.85 C_S_1.1 CS_4.P4
IN-_1
  Top 0.3: R_S1_1.1 13.22,3.15 C_S_1.2 arc-90 11.72,3 10.53,3 CS_4.P5
INDEX1  (via drill 0.4)
  Top 0.3: U$14.41 7.25,17.62 7.5,17.62 7.5,17 v7.62,17
  Route2 0.3: v7.62,17 8,17 8.5,16.5 9.5,16.5 10.62,15.38 13.88,15.38 15.12,14.12 v15.25,13.62
  Bottom 0.3: ENC1.6 14.03,13.62 v15.25,13.62
INV_OUT1  (via drill 0.7)
  Top 0.5: D_FLYBACK1_1.A 21,6.5 21.38,7.38 v22,8.5 | U$9.P$1 26.5,12.45 26.5,10.5
  Bottom 0.5: D_FLYBACK2_1.C 21.85,8.75 v22,8.5
  other vias: 22,10.5 23.5,10.5 23.5,8.5 27,8.75 27,10.5
  pour Top (rank 2, no thermals): 21.12,3.88 21.12,11.75 30.5,11.75 30.5,3.88
  pour Bottom (rank 2, no thermals): 21.12,7.25 21.12,11.75 30.5,11.75 25.75,0.38
INV_OUT2  (via drill 0.7)
  Top 0.5: D_FLYBACK1_2.A 21.38,23.5 21.38,22.5 22,22.5 v22,21.5
  Bottom 0.5: D_FLYBACK2_2.C 22.1,21.25 v22,21.5
  other vias: 23.5,21.5 23.5,19.5 22,19.5 27,19.5 27,21.25
  pour Top (rank 3, no thermals): 21.12,24.12 21.12,16.75 30.5,16.75 30.5,24.12
  pour Bottom (rank 3, no thermals): 21.12,22.75 21.12,16.25 30.5,16.25 25.38,27.88
INV_OUT3  (via drill 0.7)
  other vias: 22,17.25 22,12.75 23.5,17.25 23.5,12.75 22,15 23.5,15
  pour Bottom (rank 2, no thermals): 21.12,12.25 21.12,17.75 30.5,17.75 30.5,12.25
  pour Top (rank 2, no thermals): 21.12,17.75 21.12,12.25 30.5,12.25 30.5,17.75
LED_1  (via drill 0.4)
  Top 0.3: U$14.2 4.38,16.5 v4.38,16.62
  Bottom 0.3: v4.38,16.62 R_LED_1.2
LED_2  (via drill 0.4)
  Top 0.3: U$14.3 4.38,16 v4.38,15.62
  Bottom 0.3: R_LED_2.2 v4.38,15.62
LED_3  (via drill 0.4)
  Top 0.3: U$14.4 3.75,15.5 3.75,15 4.38,15 v4.38,14.38
  Bottom 0.3: R_LED_3.2 v4.38,14.38
LED_4  (via drill 0.4)
  Top 0.3: U$14.6 3.62,14.5 3.62,13.75 4.38,13.75 v4.38,13.12
  Bottom 0.3: R_LED_4.2 v4.38,13.12
LOAD_ISET_1
  Bottom 0.3: FPF2123.4 9.97,7.55 R6.2
MAGDEC1
  Bottom 0.3: ENC1.2 16.62,13 15.5,14.25 14.62,14.25 14.5,14.38 12.75,14.38 12.12,13.75 11.88,13.75 11.38,13.25 LED_MAG_Y1.ANODE 11.15,13.18 11.15,12 R_MAG_Y1.1
MAGINC1
  Bottom 0.3: ENC1.1 17.27,12.97 15.75,14.75 14.88,14.75 14.75,14.88 12.5,14.88 11.88,14.25 LED_MAG_G1.ANODE 11.07,14.88 8.97,14.88 R_MAG_G1.1
MBUS_SCL_1
  Top 0.25: U$14.38 8.75,20 9.88,20 9.88,23 8,23
  Top 0.3: R12.1 9.65,26.75 | U$57.P$2 16.5,26.75 9.65,26.75 | 8,23 8,25.25 8.88,25.25 8.88,26.62 9,26.75 9.65,26.75
MBUS_SDA_1
  Top 0.25: 9.25,18.75 10.62,18.75 10.62,23.75 9.38,23.75 9.38,26
  Top 0.3: U$57.P$4 14.5,26.25 9.78,26.25 R11.1 9.38,26 | U$14.37 9.25,18.75
N$3
  Bottom 0.25: U$37.P$7 7.62,27.12 L1.1
N$4
  Bottom 0.3: LED4.ANODE R_LED_4.1
N$5
  Bottom 0.3: LED3.ANODE R_LED_3.1
N$6
  Top 0.3: R_RS1.2 10.03,24.25 11.12,24.25 11.12,22.48 CAN_TRAN1.8
N$8
  Bottom 0.3: LED2.ANODE R_LED_2.1
N$10
  Bottom 0.3: LED1.ANODE R_LED_1.1
N$15
  Bottom 0.3: LED_POS1.ANODE 7.78,19.32 R_POS1.2
N$17  (via drill 0.5)
  Top 0.3: D_OV_1.A v11.75,8.62
  Bottom 0.3: 11.38,9.45 9.97,9.45 R4.2 | v11.75,8.62 11.38,9.45 | 11.38,9.45 FPF2123.5
POS_PWM1  (via drill 0.4)
  Top 0.3: U$14.39 8.25,17.5 8.75,17.5 v8.75,17.25
  Route2 0.3: v8.75,17.25 9,17 9.62,17 10.75,15.88 v14.5,15.88
  Bottom 0.3: ENC1.12 14.68,15.88 v14.5,15.88 | LED_POS1.CATHODE 8.75,18.18 v8.75,17.25
PWM_H_1  (via drill 0.4)
  Top 0.3: U$14.29 v7.5,13.5
  Route2 0.25: 18.12,1.5 15,1.25 12.25,1.5 11,1.62 8.88,2.62
  Route2 0.3: v23,6.25 23,4.12 22.75,3.62 21.75,3.62 19.38,3.25 arc90 18.12,2.12 18.12,1.5 | 8.88,2.62 8.88,10.75 9.38,11 9.38,11.75 8.12,12.38 8.12,13 v7.5,13.5
  Bottom 0.3: U$64.P2 23,4.58 v23,6.25
PWM_H_2  (via drill 0.4)
  Top 0.3: U$14.30 12.25,14 12.75,13.25 v13.38,13
  Route15 0.3: v23.5,26.25 22.25,27.5 18.62,27.5 17.75,28.5 16.38,28.5 15.62,27.12 15.5,26.62 arc-90 16.5,25.62 16.5,22.12 15.5,21.12 15.5,16.62 15.62,16.5 15.62,15.75 16.5,14.75 16.5,12 14.38,12 v13.38,13
  Bottom 0.3: U$73.P2 23.32,26.07 v23.5,26.25
PWM_H_3  (via drill 0.4)
  Top 0.3: U$14.31 12.5,14.5 v13.12,13.75 | U$82.P2 15.07,22.2 v15.38,22.5
  Route15 0.3: v15.38,22.5 13.38,20.62 13.38,20.25 13.12,19.88 v13.12,13.75
PWM_L_1  (via drill 0.4)
  Top 0.3: U$14.26 9.75,12 9.75,12.62 v7.5,12.62
  Route2 0.25: 18.62,1.12 15,0.87 10.75,1.25 8.38,2.25
  Route2 0.3: v23.5,3.75 22.88,3.12 21.75,3.12 19.5,2.75 arc90 18.62,2 18.62,1.12 | 8.38,2.25 8.38,10.5 8,11 8,11.62 7.5,11.88 v7.5,12.62
  Bottom 0.3: U$64.P4 23.02,3.27 v23.5,3.75
PWM_L_2  (via drill 0.4)
  Top 0.3: U$14.27 v12.75,12.5 12.88,12.5
  Route15 0.3: v23,23.5 22.88,23.5 22.88,26.25 22.12,27 18.5,27 17.5,28 16.75,28 16.25,27.12 16.25,27 17,26.12 17,22 16,21 16,18.5 16.88,17.5 16.88,17 16.62,16.5 16.62,16.25 arc90 17.75,15.12 arc-90 18.88,14 arc-90 17.75,12.88 17,12.88 17,11.5 14.25,11.5 v12.75,12.5
  Bottom 0.3: U$73.P4 23,24.77 v23,23.5
PWM_L_3  (via drill 0.4)
  Top 0.3: U$82.P4 13.25,21.48 13.25,21 v12.75,20.5 | U$14.28 11.62,13 v12.12,13.12
  Route15 0.3: v12.12,13.12 12.5,13.5 12.5,20.25 v12.75,20.5
QEPA1  (via drill 0.4)
  Top 0.3: U$14.42 v6.75,16.88
  Route2 0.3: v6.75,16.88 7.25,16.38 8,16.38 8.38,16 9.38,16 10.5,14.88 13.62,14.88 14.5,14 14.5,13.62 14.62,13.4 15.38,12.75 v15.88,12.62
  Bottom 0.3: ENC1.3 15.97,12.53 v15.88,12.62
QEPB1  (via drill 0.4)
  Top 0.3: U$14.43 6.25,17.25 6,17.25 v6,16.38
  Route2 0.3: v14.62,12.62 14,13.5 14,13.88 13.5,14.38 10.38,14.38 9.25,15.5 8.12,15.5 7.75,15.88 7.12,15.88 6.75,16.25 6,16.25 v6,16.38
  Bottom 0.3: ENC1.4 15.32,12.18 15.25,12.25 15.25,12.62 v14.62,12.62
V+  (via drill 0.4, 0.5, 0.6, 0.7, 0.8, 1)
  Top 0.3: v17.88,26.25 17.73,26.38 | 18,3.75 v18.12,3.88 | U$82.P6 14.43,18.18 14,17.75 13,17.75 13,16 | R_S1_1.2 15.25,3.12
  Top 0.5: D_FLYBACK1_2.C 19.62,23.47 U$71.1
  Bottom 0.25: U$37.P$2 U$37.P$3 12.35,26.62
  Bottom 0.3: U$73.P6 18.62,25.43 v17.88,26.25 | U$64.P6 18.12,3.92 v18.12,3.88 | D_UV_2.C 14.25,26.48 CIN_1.1 12.35,26.62
  Bottom 0.6: D_UV_2.C 14.43,26.25 v17.88,26.25
  other vias: 17.75,16.25 17.75,21.25 18.25,12 18.25,9.75 19.62,1.88 20.88,2.12
  pour Top (rank 5, no thermals): 15,23.75 30,23.75 30,0 15,0
  pour Top (rank 4): 17,17.25 12.25,17.25 12.25,9.12 17,3.75
  pour Route15: 16.25,30.12 arc-90 30,15 arc-90 16.25,0.12
V_BATT  (via drill 1)
  Top 0.3: 13.88,4 13.88,2.38 R_S2_1.2 13.62,1 11,1.25 7.88,2.5 CS_4.P3 6.9,3.27 C_CS_DC_4.1 | 13.88,4 15.62,4 R_CS_4.2 | 13.88,4 R_V_SENSE_1_2.2
  Top 1: D_OV_1.C v16.5,5.88 R_CS_4.2
V_REF_CS
  Top 0.3: R_CS_REF1_4.1 R_CS_REF2_4.2 CS_4.P1
VS_OUT
  Top 0.3: R_V_SENSE_1_2.1 R_V_SENSE_2_2.2 11.62,7.38 7.12,9.12 6.75,9.12 U$14.19
(copper drawn outside any net)
  shapes: Bottom circle x4, Top circle x4

### Text on the board
tPlace: GND | Piccoli | Matthew | - | 2014 | 3.3 | + | V+